# EAGLE schematic 2PDT Switch Breakout (EAGLE 9.5.0)
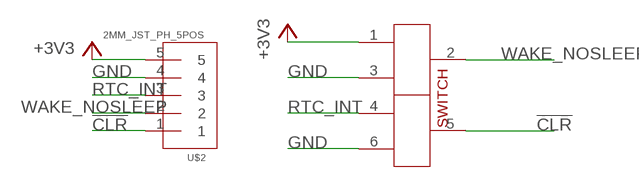
[diagram p0: schematic, sheet 1]

## Parts
U$1  2PDT_SWITCH  [2PDT_SWITCH_SMD]
U$2  2MM_JST_PH_5POS  [2MM_5POS_HEADER]

## Nets
!CLR: U$1.5 U$2.1
+3V3: U$1.1 U$2.5
GND: U$1.3 U$1.6 U$2.4
RTC_INT: U$1.4 U$2.3
WAKE_NOSLEEP: U$1.2 U$2.2

## Library data of the parts
U$1 = eDNA:2PDT_SWITCH: Double Pole Double Throw ON OFF ON switch. https://www.digikey.com/product-detail/en/e-switch/100DP1T1B1M2QEH/EG2400-ND/378869
U$2 = eDNA:2MM_JST_PH_5POS: 5POS JST female, 5 position https://www.digikey.com/product-detail/en/jst-sales-america-inc/B5B-PH-K-S-LF-SN/455-1707-ND/926614